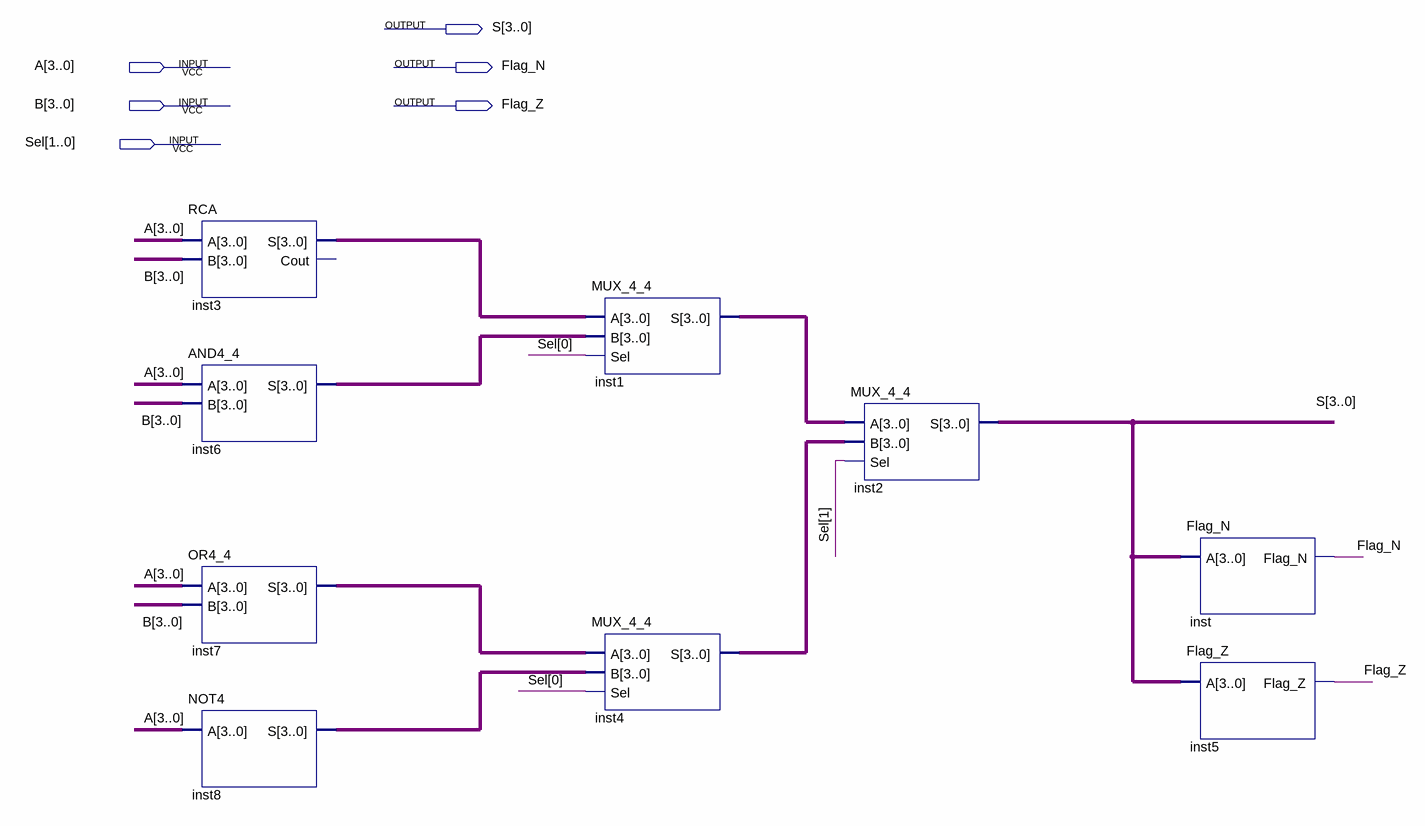
[diagram p0: schematic sheet]
// Quartus schematic ULA.bdf as structural Verilog: 9 symbols, 6 pins
module ULA (
  input  [3:0] A,
  input  [3:0] B,
  input  [1:0] Sel,
  output [3:0] S,
  output Flag_N,
  output Flag_Z
);

  wire [3:0] inst1_s, inst3_s, inst4_s, inst6_s, inst7_s, inst8_s;

  RCA inst3 (.A(A), .B(B), .S(inst3_s));  // open: Cout
  AND4_4 inst6 (.A(A), .B(B), .S(inst6_s));
  OR4_4 inst7 (.A(A), .B(B), .S(inst7_s));
  NOT4 inst8 (.A(A), .S(inst8_s));
  MUX_4_4 inst1 (.A(inst3_s), .B(inst6_s), .Sel(Sel[0]), .S(inst1_s));
  MUX_4_4 inst4 (.A(inst7_s), .B(inst8_s), .Sel(Sel[0]), .S(inst4_s));
  MUX_4_4 inst2 (.A(inst1_s), .B(inst4_s), .Sel(Sel[1]), .S(S));
  Flag_N inst (.A(S), .Flag_N(Flag_N));
  Flag_Z inst5 (.A(S), .Flag_Z(Flag_Z));
endmodule
